# EasyEDA schematic SCH_Line Following Robot_2023-12-15.json
TITLE: Line Following Robot; REV: 1.0; Date: 2023-10-19; Sheet: 1/1; Drawn By: Simon Raman; Company: HOGENT
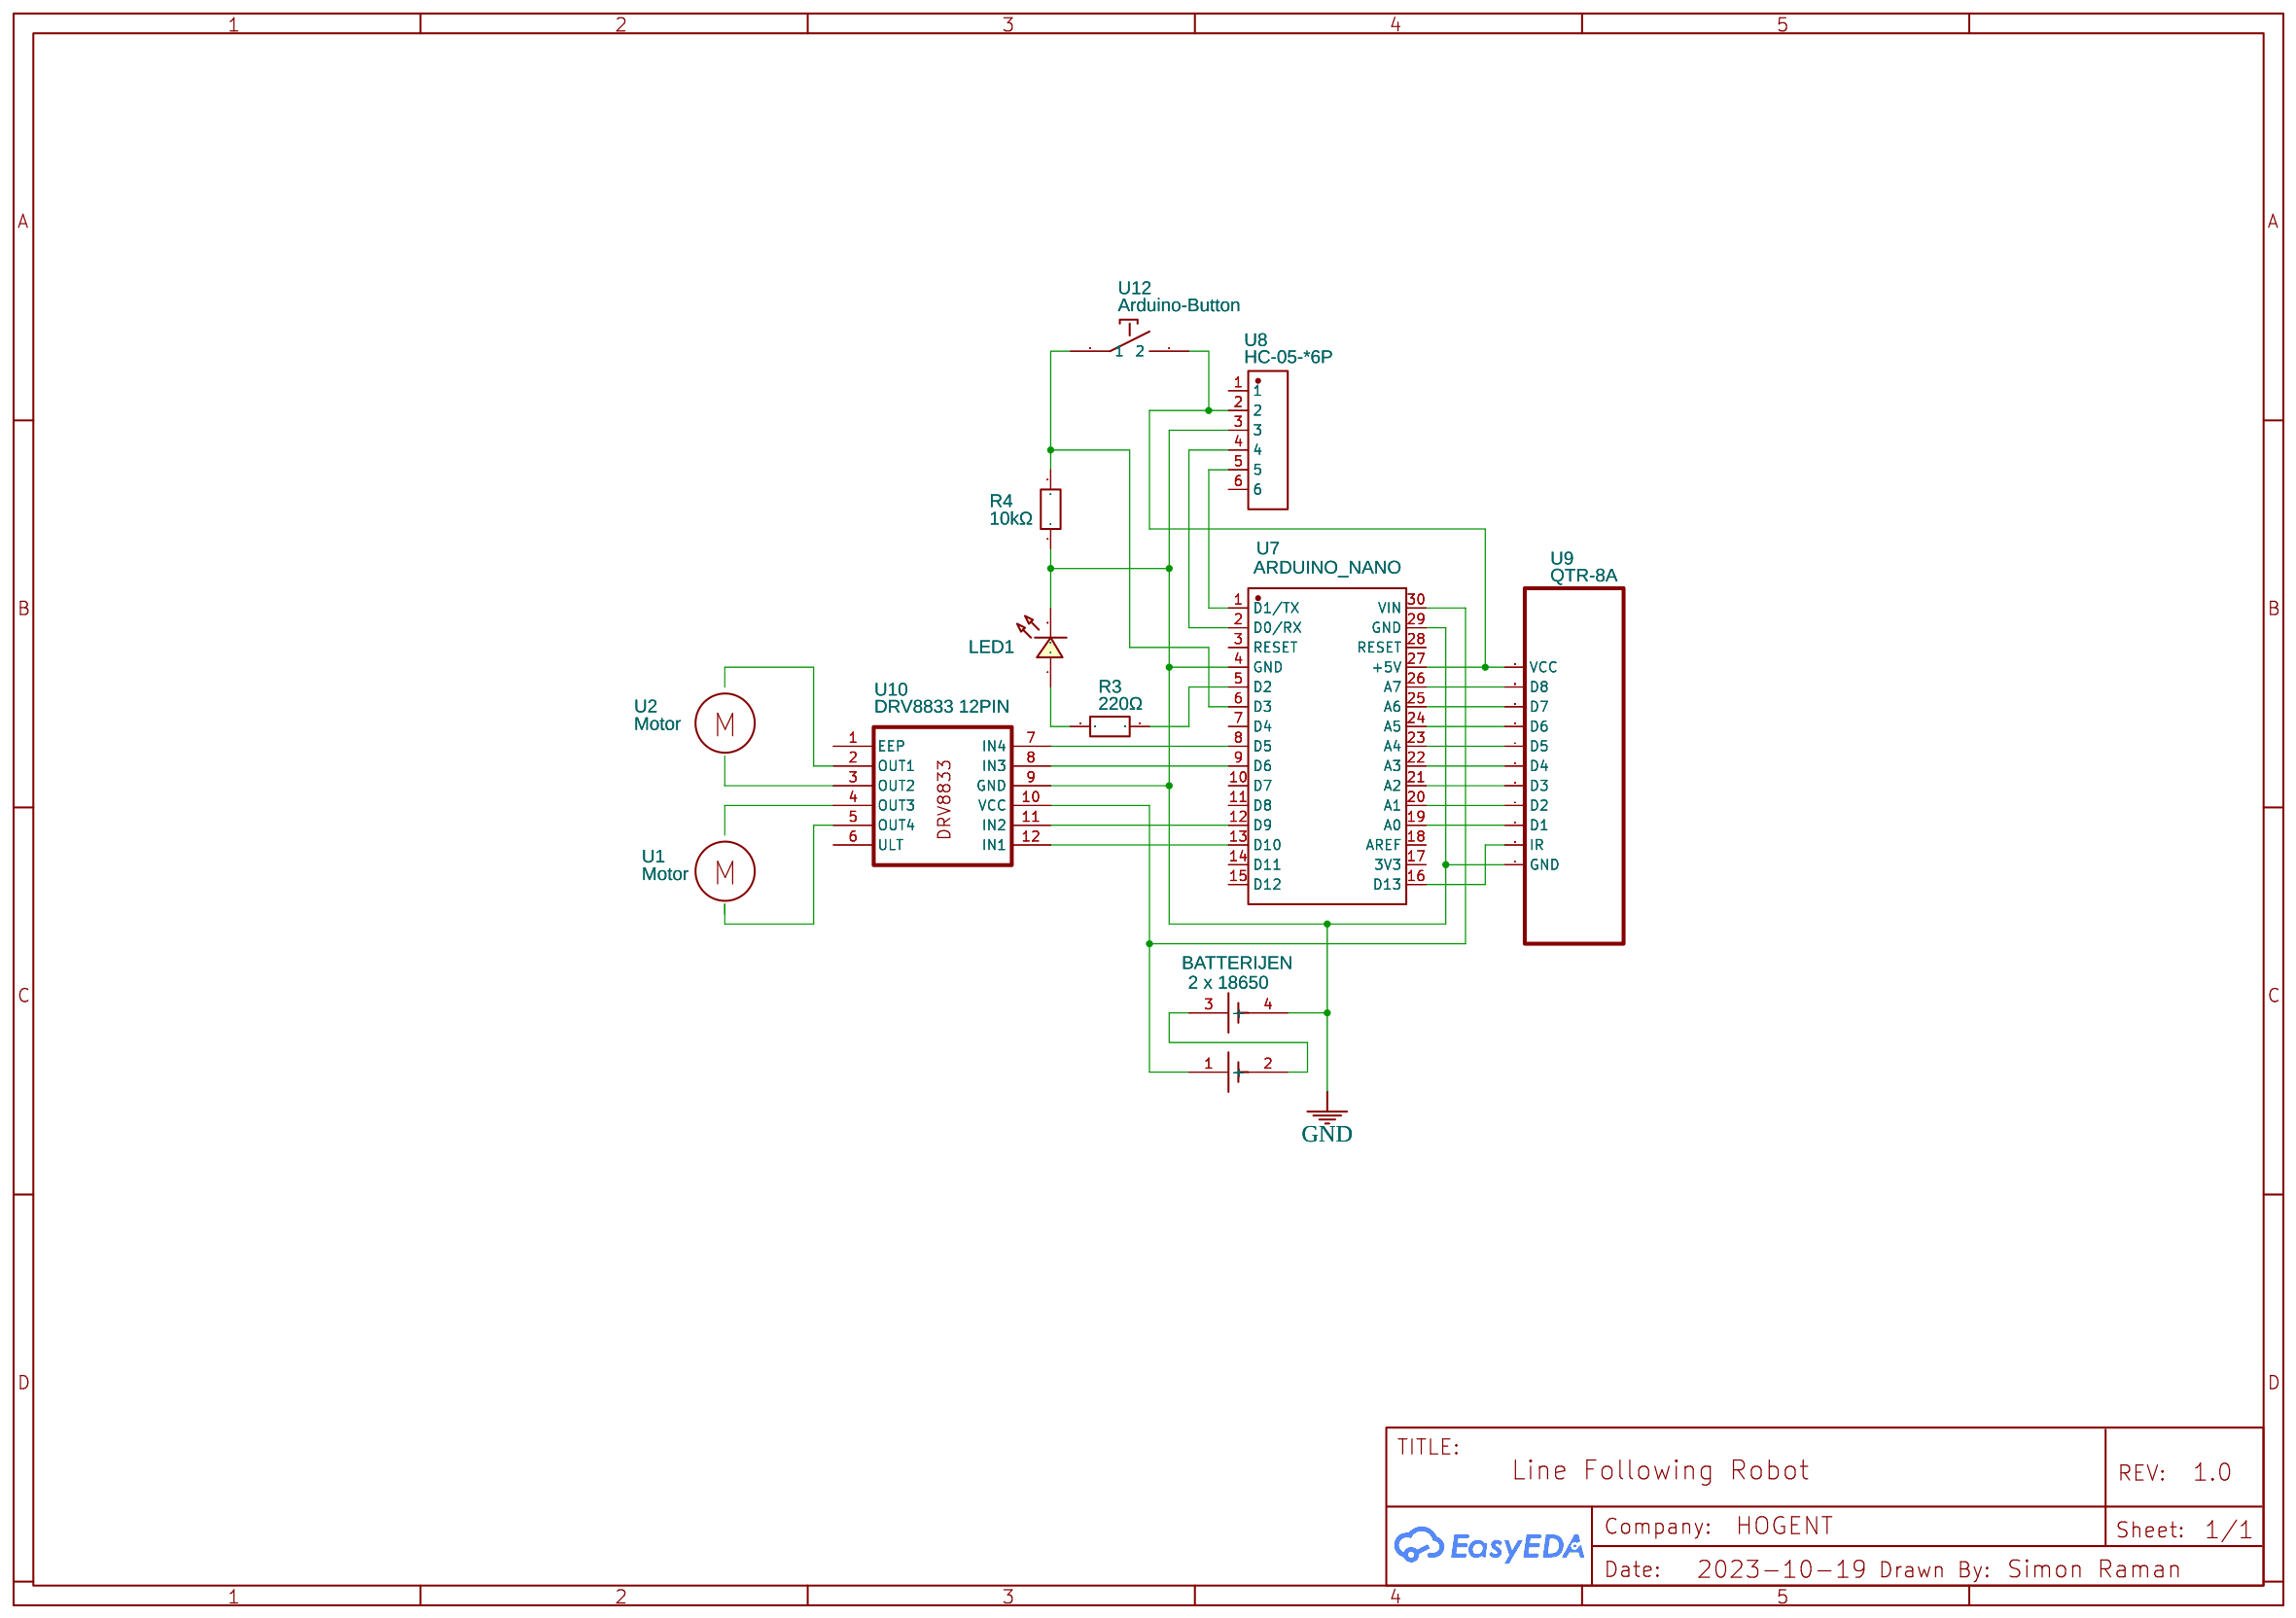
[diagram p0: schematic sheet]

## Parts
BATTERIJEN  2 x 18650  [MPD_BK_18650_PC4]
LED1  LED-TH-5mm_R  [LED-TH_BD5.0_RED]
R3  220Ω  [AXIAL RESISTOR 220 OHM - TH_BD2.3-L6.0-P10.00-D0.4]
R4  10kΩ  [AXIAL RESISTOR 220 OHM - TH_BD2.3-L6.0-P10.00-D0.4]
U1  Motor  [POLOLU_MICRO_METAL_GEARMOTOR]
U2  Motor  [POLOLU_MICRO_METAL_GEARMOTOR]
U7  ARDUINO_NANO  [COMM-TH_ARDUINO_NANO]
U8  HC-05-*6P  [HDR-TH_6P-P2.50-V-F-R1-C6]
U9  QTR-8A  [LINE SENSOR]
U10  DRV8833 12PIN  [DRV8833 (NO ORIGINAL)]
U12  Arduino-Button  [ARDUINOBUTTON_SCHEMATIC]

## Library data of the parts
BATTERIJEN = BAT_X2_18650: Manufacturer: Dex; Supplier: Dex; Supplier Part: BAT_X2; Contributor: MSeb
LED1 = LED-TH-5mm_R: Manufacturer: EVERLIGHT(台湾亿光); Manufacturer Part: 333-2SURD/S530-A3; Supplier Part: C87271; Supplier: LCSC; Contributor: LCEDA_Lib
R3 R4 = AXIAL RESISTOR 220 OHM - TH_BD2.3-L6.0-P10.00-D0.4: Contributor: Waleed Kies; JLCPCB Part Class: Extended Part
U1 U2 = Motor: Contributor: hirobon1690
U7 = ARDUINO_NANO: Contributor: lcsc; Supplier: LCSC; Supplier Part: C9900017879; Manufacturer: null; JLCPCB Part Class: Extended Part; link: https://lcsc.com/eda_search?q=C9900017879&%26type=1&ref=editor
U8 = HC-05-*6P: Contributor: LCSC; Supplier: LCSC; Supplier Part: C9900003093; Manufacturer: null; Manufacturer Part: HC-05_排母*6P; JLCPCB Part Class: Extended Part; link: https://lcsc.com/eda_search?q=C9900003093&%26type=1&ref=editor
U9 = QTR-8A: Contributor: giedresim
U10 = DRV8833 12PIN: Contributor: PiterSantaCruz
U12 = Arduino-Button: Manufacturer Part: SW100664; Supplier Part: SW100664; Contributor: RasenderReporter

## Nets
GND: BATTERIJEN.4(-) LED1.2 R4.1 U7.4(GND) U7.29(GND) U8.3 U9.1(GND) U10.9(GND)
Net-(BATTERIJEN-1): BATTERIJEN.1(+) U7.30(VIN) U10.10(VCC)
Net-(BATTERIJEN-2): BATTERIJEN.2(-) BATTERIJEN.3(+)
Net-(LED1-1): LED1.1 R3.1
Net-(R3-2): R3.2 U7.5(D2)
Net-(R4-2): R4.2 U7.6(D3) U12.1
Net-(U7-1): U7.1(D1/TX) U8.5
Net-(U7-2): U7.2(D0/RX) U8.4
Net-(U7-8): U7.8(D5) U10.7(IN4)
Net-(U7-9): U7.9(D6) U10.8(IN3)
Net-(U7-12): U7.12(D9) U10.11(IN2)
Net-(U7-13): U7.13(D10) U10.12(IN1)
Net-(U7-16): U7.16(D13) U9.2(IR)
Net-(U7-19): U7.19(A0) U9.3(D1)
Net-(U7-20): U7.20(A1) U9.4(D2)
Net-(U7-21): U7.21(A2) U9.5(D3)
Net-(U7-22): U7.22(A3) U9.6(D4)
Net-(U7-23): U7.23(A4) U9.7(D5)
Net-(U7-24): U7.24(A5) U9.8(D6)
Net-(U7-25): U7.25(A6) U9.9(D7)
Net-(U7-26): U7.26(A7) U9.10(D8)
Net-(U7-27): U7.27(+5V) U8.2 U9.11(VCC) U12.2

Not connected (* = marked no-connect by the designer): U7 3(RESET) 7(D4) 10(D7) 11(D8) 14(D11) 15(D12) 17(3V3) 18(AREF) 28(RESET); U8 1 6; U10 1(EEP) 2(OUT1) 3(OUT2) 4(OUT3) 5(OUT4) 6(ULT)
